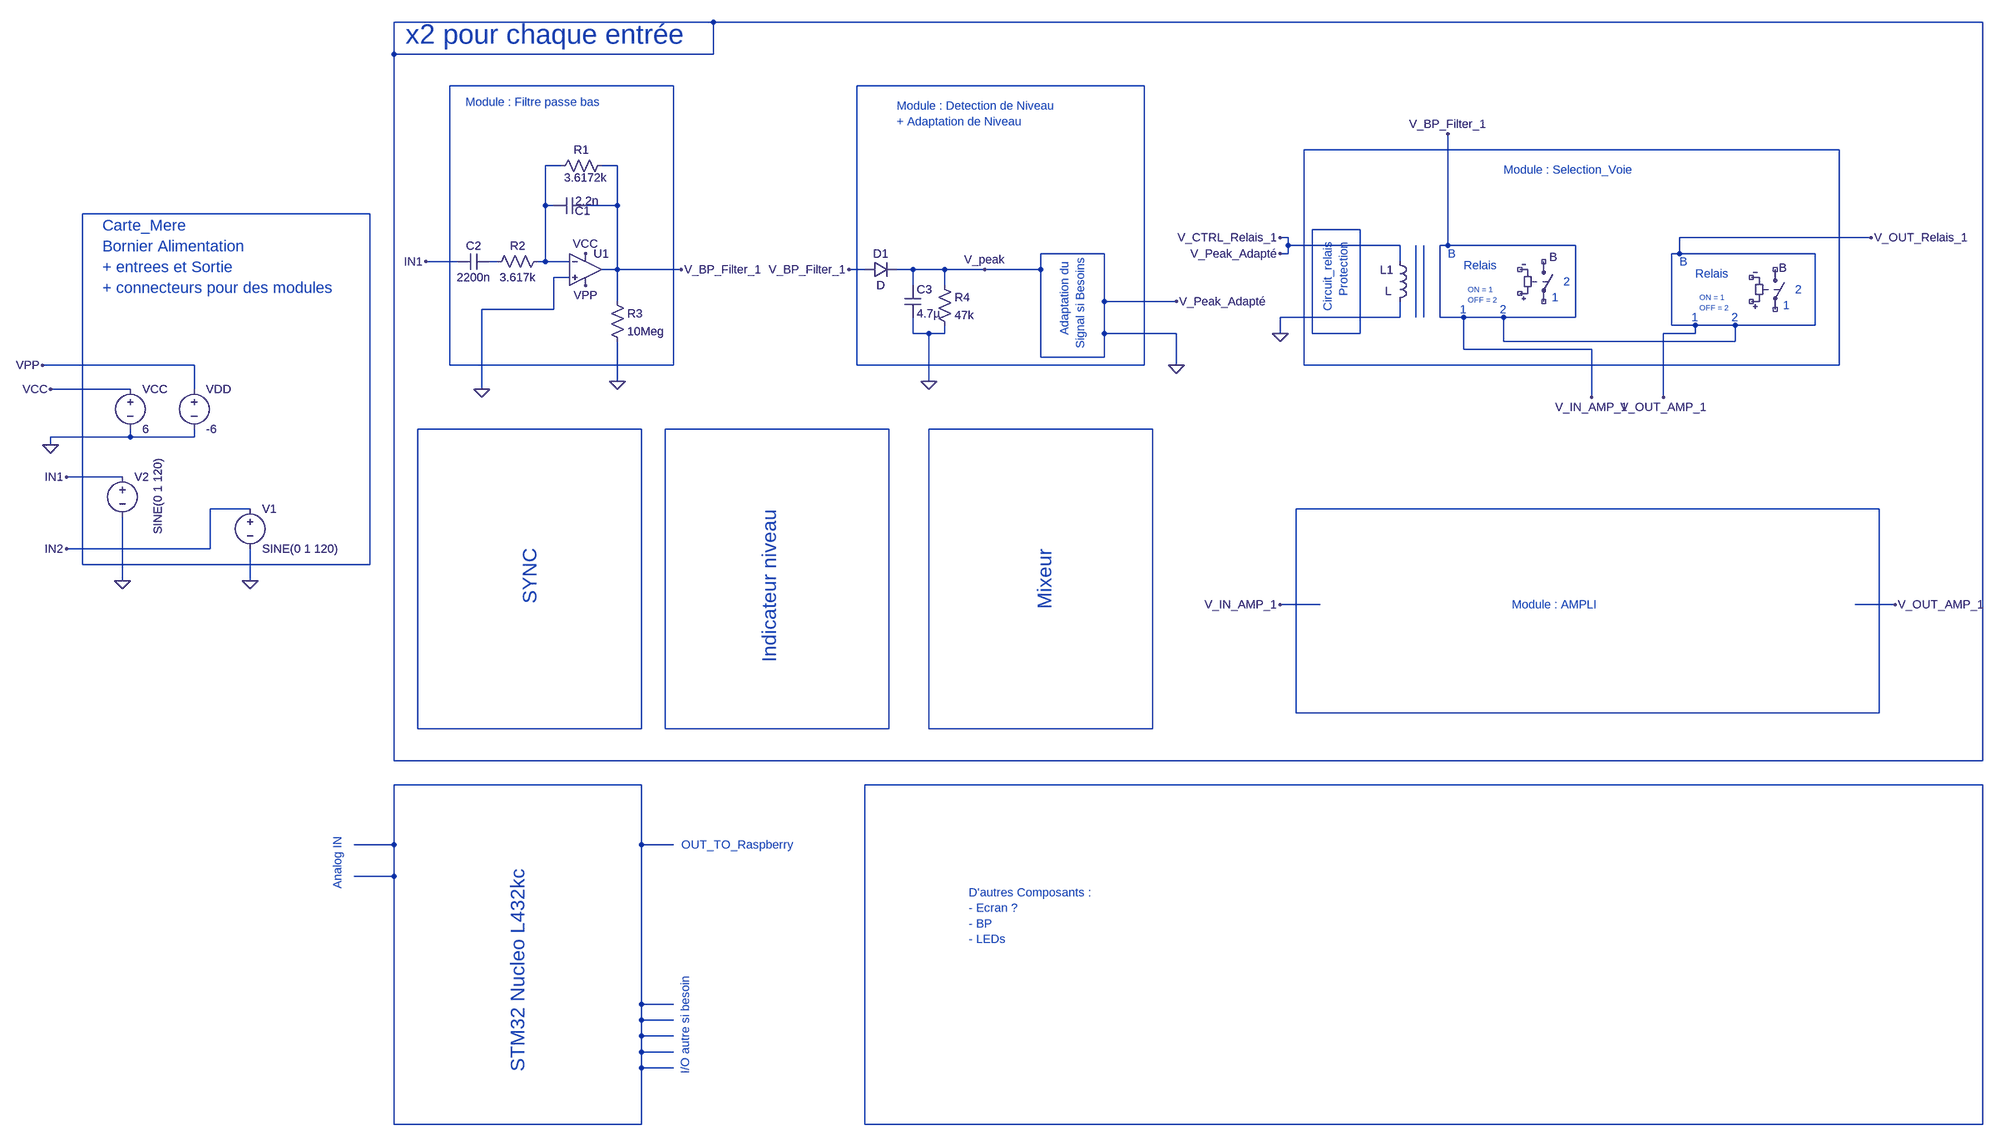
[diagram p0: schematic Schema_avec_modules.asc]
Schema_avec_modules.asc, the LTspice schematic file:
Version 4
SHEET 1 3580 1576
WIRE 528 -832 -112 -832
WIRE 3072 -832 528 -832
WIRE -112 -768 -112 -832
WIRE 528 -768 528 -832
WIRE 528 -768 -112 -768
WIRE 448 -704 0 -704
WIRE 1392 -704 816 -704
WIRE 2784 -576 1712 -576
WIRE 224 -544 192 -544
WIRE 336 -544 304 -544
WIRE 192 -464 192 -544
WIRE 208 -464 192 -464
WIRE 336 -464 336 -544
WIRE 336 -464 272 -464
WIRE -160 -448 -736 -448
WIRE 1824 -416 1728 -416
WIRE 1680 -400 1664 -400
WIRE 2848 -400 2464 -400
WIRE 1680 -384 1680 -400
WIRE 1904 -384 1680 -384
WIRE 2000 -384 2000 -608
WIRE 2000 -384 1984 -384
WIRE 2256 -384 2000 -384
WIRE 1312 -368 1184 -368
WIRE 1680 -368 1680 -384
WIRE 1680 -368 1664 -368
WIRE 2464 -368 2464 -400
WIRE 2464 -368 2448 -368
WIRE 2736 -368 2464 -368
WIRE 16 -352 -48 -352
WIRE 96 -352 80 -352
WIRE 192 -352 192 -464
WIRE 192 -352 176 -352
WIRE 240 -352 192 -352
WIRE 1904 -352 1904 -384
WIRE 336 -336 336 -464
WIRE 336 -336 304 -336
WIRE 464 -336 336 -336
WIRE 832 -336 800 -336
WIRE 928 -336 896 -336
WIRE 992 -336 928 -336
WIRE 1072 -336 992 -336
WIRE 1184 -336 1184 -368
WIRE 1184 -336 1072 -336
WIRE 240 -320 208 -320
WIRE 928 -304 928 -336
WIRE 992 -304 992 -336
WIRE 336 -272 336 -336
WIRE 1312 -272 1312 -368
WIRE 1456 -272 1312 -272
WIRE 208 -256 208 -320
WIRE 208 -256 64 -256
WIRE 1904 -240 1904 -272
WIRE 1904 -240 1664 -240
WIRE 1936 -240 1936 -384
WIRE 1952 -240 1952 -384
WIRE 1984 -240 1984 -384
WIRE 2032 -240 1984 -240
WIRE 2112 -240 2032 -240
WIRE 2256 -240 2256 -384
WIRE 2256 -240 2112 -240
WIRE 2448 -224 2448 -368
WIRE 2496 -224 2448 -224
WIRE 2576 -224 2496 -224
WIRE 2736 -224 2736 -368
WIRE 2736 -224 2576 -224
WIRE 928 -208 928 -240
WIRE 960 -208 928 -208
WIRE 992 -208 992 -224
WIRE 992 -208 960 -208
WIRE 1312 -208 1312 -272
WIRE 1456 -208 1312 -208
WIRE 1664 -208 1664 -240
WIRE 1728 -208 1728 -416
WIRE 1824 -208 1824 -416
WIRE 1824 -208 1728 -208
WIRE 2496 -208 2496 -224
WIRE 2496 -208 2432 -208
WIRE 2112 -192 2112 -240
WIRE 2576 -192 2576 -224
WIRE 2576 -192 2112 -192
WIRE 2032 -176 2032 -240
WIRE 2288 -176 2032 -176
WIRE 1184 -160 1184 -336
WIRE 1312 -160 1312 -208
WIRE 1312 -160 1184 -160
WIRE -512 -144 -816 -144
WIRE 0 -144 0 -704
WIRE 448 -144 448 -704
WIRE 448 -144 0 -144
WIRE 816 -144 816 -704
WIRE 1392 -144 1392 -704
WIRE 1392 -144 816 -144
WIRE 1456 -144 1456 -208
WIRE 1712 -144 1712 -576
WIRE 2784 -144 2784 -576
WIRE 2784 -144 1712 -144
WIRE 336 -112 336 -192
WIRE 960 -112 960 -208
WIRE -640 -96 -800 -96
WIRE -512 -96 -512 -144
WIRE 64 -96 64 -256
WIRE 2288 -80 2288 -176
WIRE 2432 -80 2432 -208
WIRE 384 -16 -64 -16
WIRE 880 -16 432 -16
WIRE 1408 -16 960 -16
WIRE -640 0 -640 -16
WIRE -640 0 -800 0
WIRE -512 0 -512 -16
WIRE -512 0 -640 0
WIRE -800 16 -800 0
WIRE -656 80 -768 80
WIRE -400 144 -480 144
WIRE 2864 144 1696 144
WIRE -480 224 -480 144
WIRE -480 224 -768 224
WIRE -736 256 -736 -448
WIRE -160 256 -160 -448
WIRE -160 256 -736 256
WIRE -656 288 -656 160
WIRE -400 288 -400 224
WIRE 1744 336 1664 336
WIRE 2896 336 2816 336
WIRE 1696 608 1696 144
WIRE 2864 608 2864 144
WIRE 2864 608 1696 608
WIRE -64 640 -64 -16
WIRE 384 640 384 -16
WIRE 384 640 -64 640
WIRE 432 640 432 -16
WIRE 880 640 880 -16
WIRE 880 640 432 640
WIRE 960 640 960 -16
WIRE 1408 640 1408 -16
WIRE 1408 640 960 640
WIRE -112 704 -112 -768
WIRE 3072 704 3072 -832
WIRE 3072 704 -112 704
WIRE 384 752 -112 752
WIRE 3072 752 832 752
WIRE -112 912 -112 752
WIRE -112 912 -192 912
WIRE 384 912 384 752
WIRE 448 912 384 912
WIRE -112 976 -112 912
WIRE -112 976 -192 976
WIRE 384 1232 384 912
WIRE 448 1232 384 1232
WIRE 384 1264 384 1232
WIRE 448 1264 384 1264
WIRE 384 1296 384 1264
WIRE 448 1296 384 1296
WIRE 384 1328 384 1296
WIRE 448 1328 384 1328
WIRE 384 1360 384 1328
WIRE 448 1360 384 1360
WIRE -112 1568 -112 976
WIRE 384 1568 384 1360
WIRE 384 1568 -112 1568
WIRE 832 1568 832 752
WIRE 3072 1568 3072 752
WIRE 3072 1568 832 1568
FLAG -800 16 0
FLAG -800 -96 VCC
FLAG -816 -144 VPP
FLAG 272 -368 VCC
FLAG 272 -304 VPP
FLAG 64 -96 0
FLAG 464 -336 V_BP_Filter_1
FLAG 336 -112 0
FLAG 960 -112 0
FLAG -768 80 IN1
FLAG -48 -352 IN1
FLAG -656 288 0
FLAG 1072 -336 V_peak
FLAG 2000 -608 V_BP_Filter_1
FLAG -768 224 IN2
FLAG -400 288 0
FLAG 1456 -272 V_Peak_Adapté
FLAG 1456 -144 0
FLAG 1664 -400 V_CTRL_Relais_1
FLAG 1664 -208 0
FLAG 800 -336 V_BP_Filter_1
FLAG 2288 -80 V_IN_AMP_1
FLAG 2432 -80 V_OUT_AMP_1
FLAG 2848 -400 V_OUT_Relais_1
FLAG 1664 336 V_IN_AMP_1
FLAG 2896 336 V_OUT_AMP_1
FLAG 1664 -368 V_Peak_Adapté
SYMBOL OpAmps\\UniversalOpAmp 272 -336 R0
SYMATTR InstName U1
SYMBOL res 192 -368 R90
WINDOW 0 0 56 VBottom 2
WINDOW 3 32 56 VTop 2
SYMATTR InstName R2
SYMATTR Value 3.617k
SYMBOL voltage -640 -112 R0
WINDOW 123 0 0 Left 0
WINDOW 39 0 0 Left 0
SYMATTR InstName VCC
SYMATTR Value 6
SYMBOL voltage -512 -112 R0
WINDOW 123 0 0 Left 0
WINDOW 39 0 0 Left 0
SYMATTR InstName VDD
SYMATTR Value -6
SYMBOL cap 80 -368 R90
WINDOW 0 0 32 VBottom 2
WINDOW 3 32 32 VTop 2
SYMATTR InstName C2
SYMATTR Value 2200n
SYMBOL cap 272 -480 R90
WINDOW 0 42 6 VBottom 2
WINDOW 3 -9 -3 VTop 2
SYMATTR InstName C1
SYMATTR Value 2.2n
SYMBOL res 320 -560 R90
WINDOW 0 0 56 VBottom 2
WINDOW 3 24 48 VTop 2
SYMATTR InstName R1
SYMATTR Value 3.6172k
SYMBOL res 320 -288 R0
SYMATTR InstName R3
SYMATTR Value 10Meg
SYMBOL res 976 -320 R0
SYMATTR InstName R4
SYMATTR Value 47k
SYMBOL cap 912 -304 R0
SYMATTR InstName C3
SYMATTR Value 4.7µ
SYMBOL diode 832 -320 R270
WINDOW 0 32 32 VTop 2
WINDOW 3 0 32 VBottom 2
SYMATTR InstName D1
SYMBOL voltage -656 64 R0
WINDOW 123 0 0 Left 0
WINDOW 39 0 0 Left 0
WINDOW 3 72 -22 VRight 2
SYMATTR Value SINE(0 1 120)
SYMATTR InstName V2
SYMBOL ind 1888 -368 R0
WINDOW 0 -24 33 Left 2
WINDOW 3 -14 75 Left 2
SYMATTR InstName L1
SYMBOL sw 2656 -352 R0
WINDOW 0 7 13 Left 2
SYMATTR InstName B
SYMATTR Value ""
SYMBOL sw 2192 -368 R0
WINDOW 0 11 7 Left 2
SYMATTR InstName B
SYMATTR Value ""
SYMBOL voltage -400 128 R0
WINDOW 123 0 0 Left 0
WINDOW 39 0 0 Left 0
SYMATTR InstName V1
SYMATTR Value SINE(0 1 120)
TEXT 1232 -360 VRight 2 ;Adaptation du \nSignal si Besoins
TEXT 2128 336 Left 2 ;Module : AMPLI
TEXT 2032 -344 Left 2 ;Relais
TEXT 2024 -256 Left 2 ;1
TEXT 2104 -256 Left 2 ;2
TEXT 2040 -296 Left 1 ;ON = 1\nOFF = 2
TEXT 2496 -328 Left 2 ;Relais
TEXT 2488 -240 Left 2 ;1
TEXT 2568 -240 Left 2 ;2
TEXT 2504 -280 Left 1 ;ON = 1\nOFF = 2
TEXT 2696 -296 Left 2 ;2
TEXT 2672 -264 Left 2 ;1
TEXT 2232 -312 Left 2 ;2
TEXT 2208 -280 Left 2 ;1
TEXT 2000 -368 Left 2 ;B
TEXT 2464 -352 Left 2 ;B
TEXT -696 -424 Left 3 ;Carte_Mere\nBornier Alimentation \n+ entrees et Sortie\n+ connecteurs pour des modules
TEXT 32 -672 Left 2 ;Module : Filtre passe bas
TEXT 896 -664 Left 2 ;Module : Detection de Niveau \n+ Adaptation de Niveau
TEXT 1760 -392 VRight 2 ;Circuit_relais\nProtection
TEXT 2112 -536 Left 2 ;Module : Selection_Voie
TEXT -88 -808 Left 5 ;x2 pour chaque entrée
TEXT 136 960 VRight 4 ;STM32 Nucleo L432kc
TEXT -224 896 VRight 2 ;Analog IN
TEXT 472 1176 VRight 2 ;I/O autre si besoin
TEXT 464 912 Left 2 ;OUT_TO_Raspberry
TEXT 1040 1008 Left 2 ;D'autres Composants : \n- Ecran ?\n- BP\n- LEDs
TEXT 160 224 VRight 4 ;SYNC
TEXT 640 144 VRight 4 ;Indicateur niveau
TEXT 1192 224 VRight 4 ;Mixeur

The netlist it stands for:
* Schema_avec_modules.asc
XU1 0 N005 VCC VPP V_OUT_Relais_1 level1 Avol=1Meg GBW=10Meg Vos=0 En=0 Enk=0 In=0 Ink=0 Rin=500Meg  ; pins In+ In- V+ V- OUT
R2 N005 N008 3.617k
VCC VCC 0 6
VDD VPP 0 -6
C2 N008 IN1 2200n
C1 V_OUT_Relais_1 N005 2.2n
R1 V_OUT_Relais_1 N005 3.6172k
R3 V_OUT_Relais_1 0 10Meg
R4 0 0 47k
C3 0 0 4.7µ
D1 V_OUT_Relais_1 0 D
V2 IN1 0 SINE(0 1 120)
L1 0 0 L
S§B NC_01 NC_02 NC_03 NC_04
S§B NC_05 NC_06 NC_07 NC_08
V1 IN2 0 SINE(0 1 120)
.model D D
.lib standard.dio
* Adaptation du
* Signal si Besoins
* Module : AMPLI
* Relais
* 1
* 2
* ON = 1
* OFF = 2
* Relais
* 1
* 2
* ON = 1
* OFF = 2
* 2
* 1
* 2
* 1
* B
* B
* Carte_Mere
* Bornier Alimentation
* + entrees et Sortie
* + connecteurs pour des modules
* Module : Filtre passe bas
* Module : Detection de Niveau
* + Adaptation de Niveau
* Circuit_relais
* Protection
* Module : Selection_Voie
* x2 pour chaque entrée
* STM32 Nucleo L432kc
* Analog IN
* I/O autre si besoin
* OUT_TO_Raspberry
* D'autres Composants :
* - Ecran ?
* - BP
* - LEDs
* SYNC
* Indicateur niveau
* Mixeur
.lib UniversalOpAmp1.lib
.backanno
.end